# EAGLE design VizeSinavi (EAGLE 9.6.2)
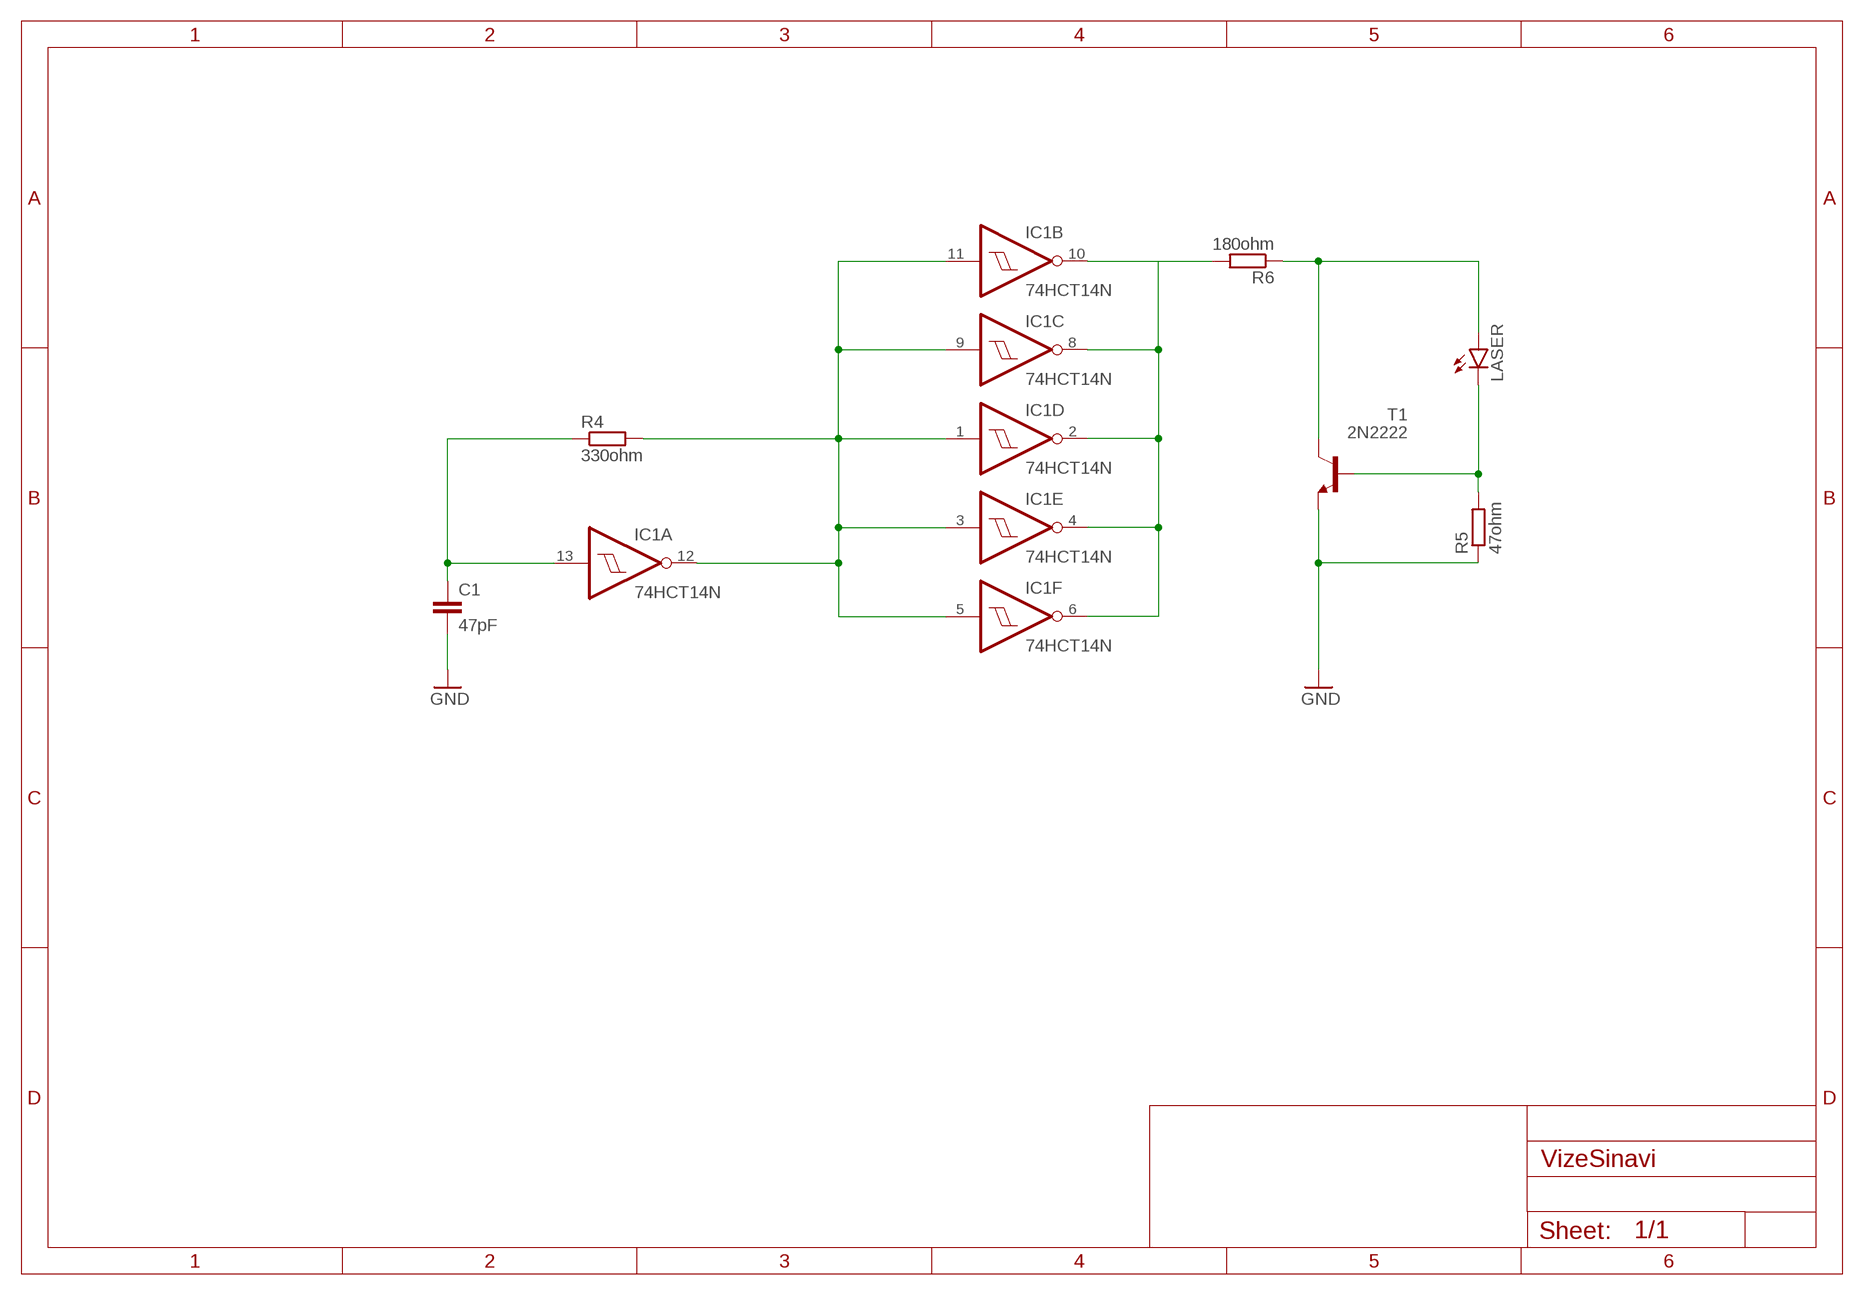
[diagram p0: schematic, sheet 1]

## Parts
C1  47pF  C2,5-3  [C2.5-3]
IC1  74HCT14N  [DIL14]
LASER  LED5MM  [LED5MM]
R4  330ohm  R-EU_0204/5  [0204/5]
R5  47ohm  R-EU_0204/5  [0204/5]
R6  180ohm  R-EU_0204/5  [0204/5]
T1  2N2222  [TO18]

## Nets
GND: C1.2 R5.1 T1.1(E)
N$1: C1.1 IC1.13(A:I) R4.1
N$2: IC1.1(D:I) IC1.3(E:I) IC1.5(F:I) IC1.9(C:I) IC1.11(B:I) IC1.12(A:O) R4.2
N$3: IC1.10(B:O) R6.2
N$4: IC1.2(D:O) IC1.4(E:O) IC1.6(F:O) IC1.8(C:O)
N$5: LASER.A R6.1 T1.3(C)
N$6: LASER.K(C) R5.2 T1.2(B)

## Power pins joined to a net without a drawn wire
GND: IC1.7(P:GND)
VCC: IC1.14(P:VCC)

## Library data of the parts
C1 = capacitor-wima:C: CAPACITOR naming: grid - package width
IC1 = 74xx-eu:74*14: Hex schmitt trigger INVERTER
LASER = led:LED: LED OSRAM: - CHIPLED LG R971, LG N971, LY N971, LG Q971, LY Q971, LO R971, LY R971 LH N974, LH R974 LS Q976, LO Q976, LY Q976 LO Q996 - Hyper CHIPLED LW Q18S LB Q993, LB Q99A, LB R99A - SideLED LS A670, LO A670, LY A670, LG A670, LP A670 LB A673, LV A673, LT A673, LW A673 LH A674 LY A675 LS A676, LA A676, LO A676, LY A676, LW A676 LS A679, LY A679, LG A679 - Hyper Micro SIDELED® LS Y876, LA Y876, LO Y876, LY Y876 LT Y87S - SmartLED LW L88C, LW L88S LB L89C, LB L89S, LG L890 LS L89K, LO L89K, LY L89K LS L896, LA L896, LO L896, LY L896 - TOPLED LS T670, LO T670, LY T670, LG T670, LP T670 LSG T670, LSP T670, LSY T670, LOP T670, LYG T670 LG T671, LOG T671, LSG T671 LB T673, LV T673, LT T673, LW T673 LH T674 LS T676, LA T676, LO T676, LY T676, LB T676, LH T676, LSB T676, LW T676 LB T67C, LV T67C, LT T67C, LS T67K, LO T67K, LY T67K, LW E67C LS E67B, LA E67B, LO E67B, LY E67B, LB E67C, LV E67C, LT E67C LW T67C LS T679, LY T679, LG T679 LS T770, LO T770, LY T770, LG T770, LP T770 LB T773, LV T773, LT T773, LW T773 LH T774 LS E675, LA E675, LY E675, LS T675 LS T776, LA T776, LO T776, LY T776, LB T776 LHGB T686 LT T68C, LB T68C - Hyper Mini TOPLED® LB M676 - Mini TOPLED Santana® LG M470 LS M47K, LO M47K, LY M47K Source: http://www.osram.convergy.de LUXEON: - LUMILED® LXK2-PW12-R00, LXK2-PW12-S00, LXK2-PW14-U00, LXK2-PW14-V00 LXK2-PM12-R00, LXK2-PM12-S00, LXK2-PM14-U00 LXK2-PE12-Q00, LXK2-PE12-R00, LXK2-PE12-S00, LXK2-PE14-T00, LXK2-PE14-U00 LXK2-PB12-K00, LXK2-PB12-L00, LXK2-PB12-M00, LXK2-PB14-N00, LXK2-PB14-P00, LXK2-PB14-Q00 LXK2-PR12-L00, LXK2-PR12-M00, LXK2-PR14-Q00, LXK2-PR14-R00 LXK2-PD12-Q00, LXK2-PD12-R00, LXK2-PD12-S00 LXK2-PH12-R00, LXK2-PH12-S00 LXK2-PL12-P00, LXK2-PL12-Q00, LXK2-PL12-R00 Source: www.luxeon.com KINGBRIGHT: KA-3528ASYC Source: www.kingbright.com
R4-R6 = rcl:R-EU_: RESISTOR, European symbol; SPICEPREFIX: R
T1 = transistor:2N2222: NPN TRANSISTOR

## Board
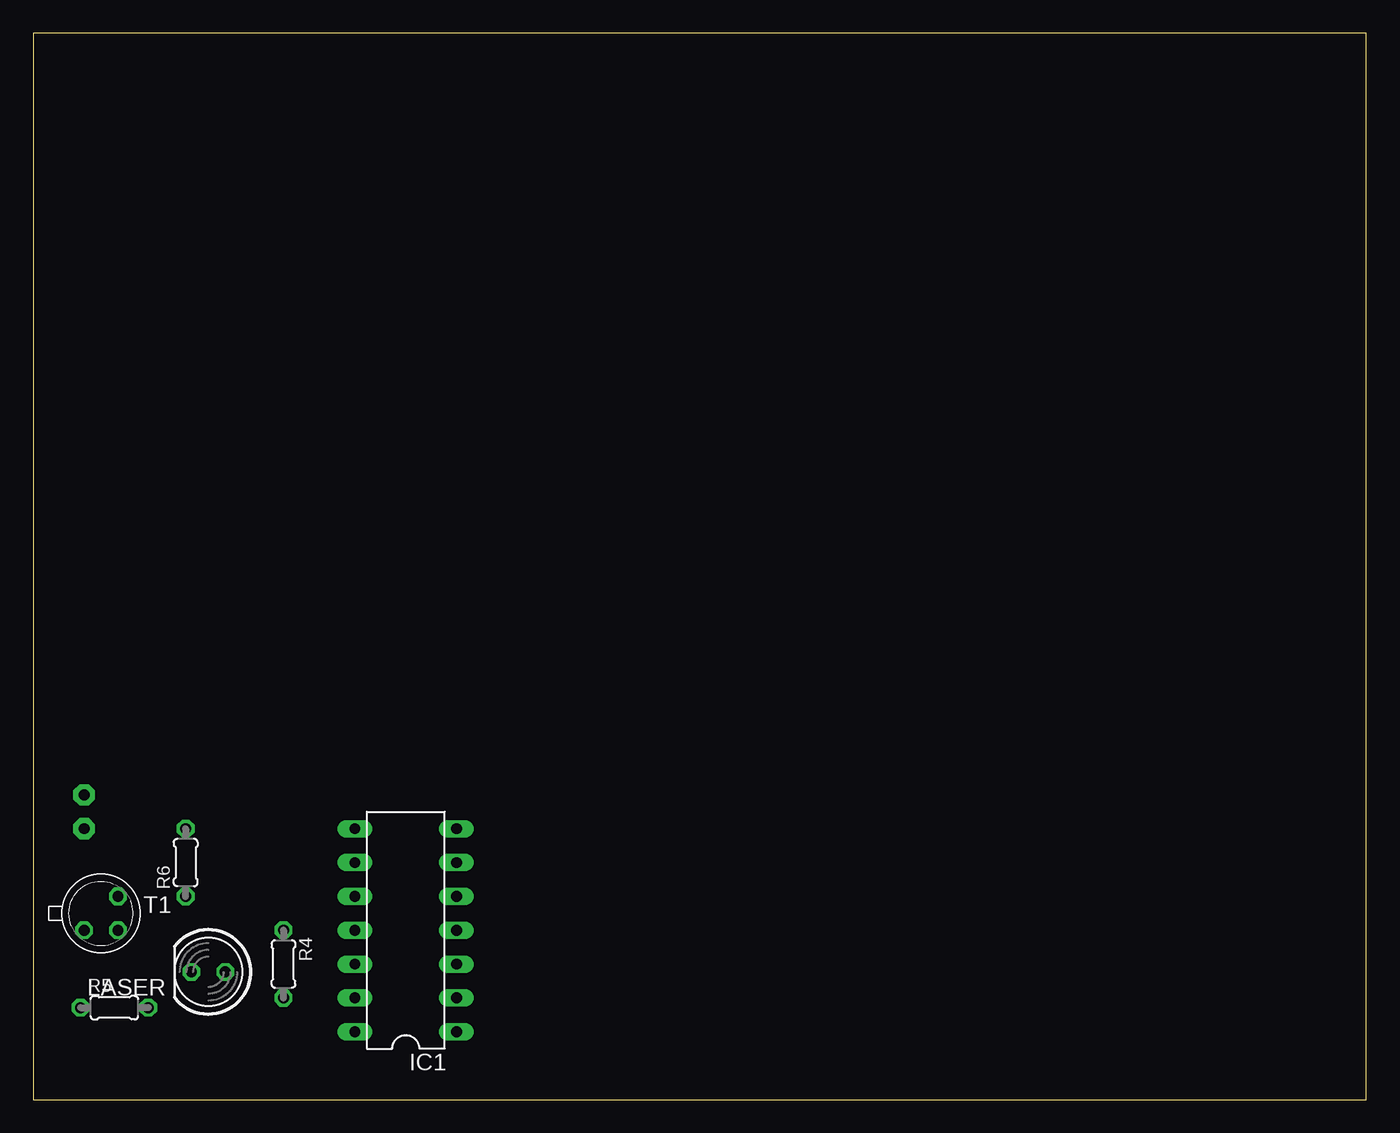
[diagram p1: board, top side]
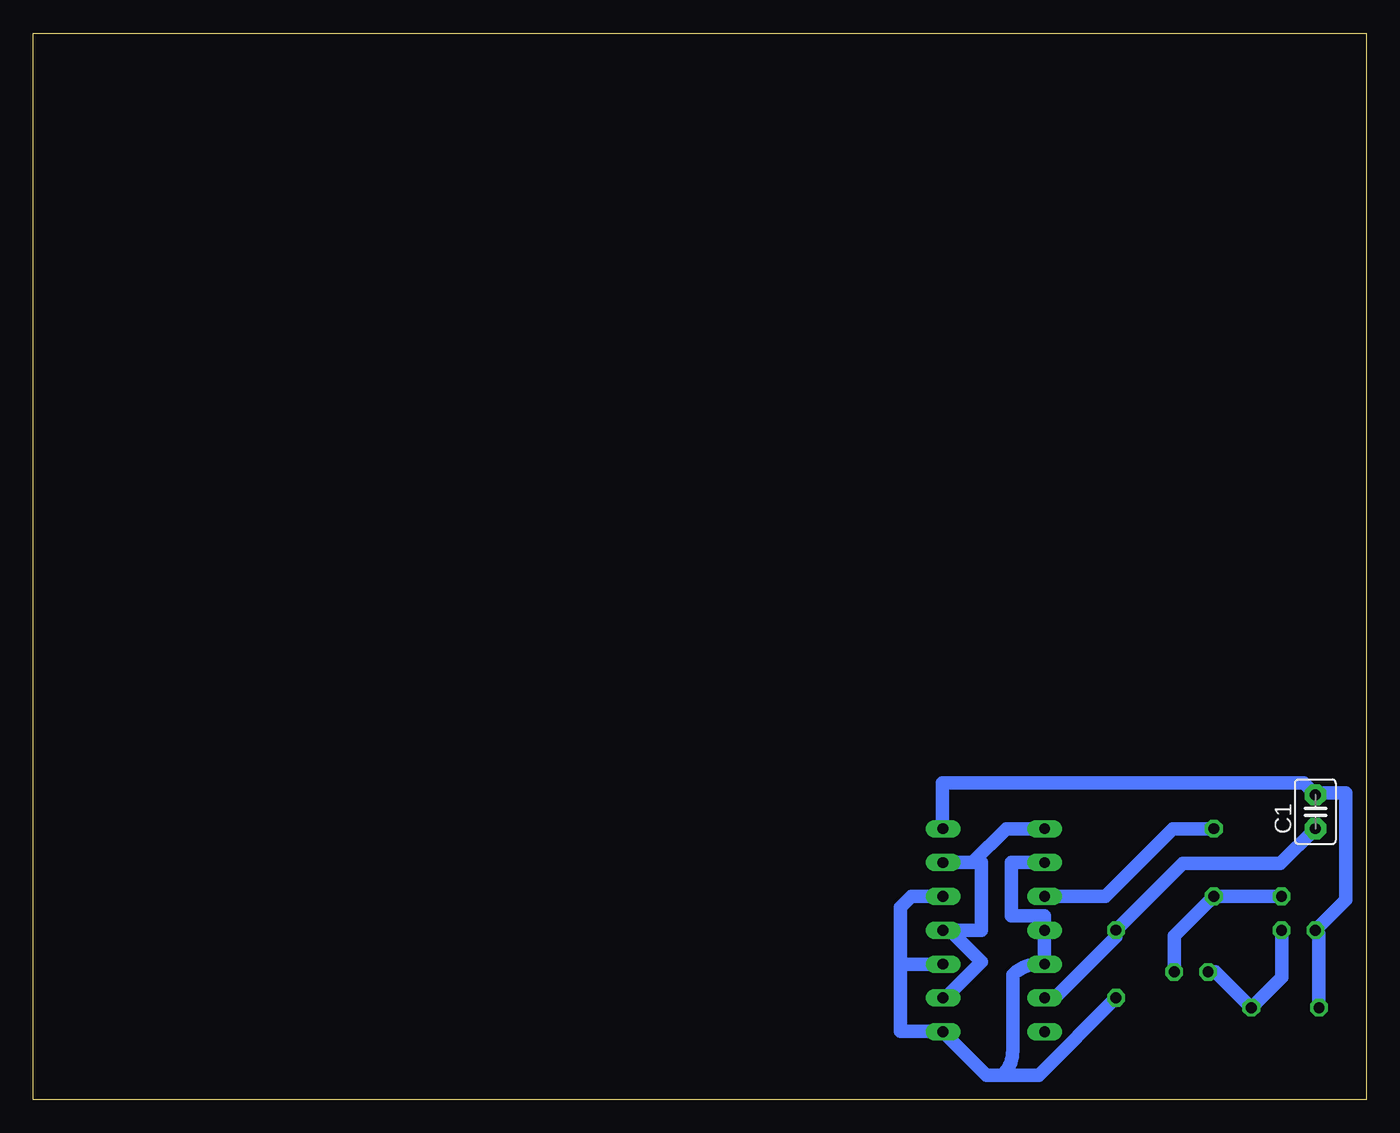
[diagram p2: board, bottom side, seen from below]

Size 100 x 80 mm. Coordinates in mm from the lower left corner, seen from the top.
Outline: 0,0 100,0 100,80 0,80 0,0
Copper layers (1*16): Top 0.035mm / dielectric 1.5mm / Bottom 0.035mm
Design rules "default": minimum track width 6mil, minimum drill 0.35mm, track to track 6mil, track to pad 6mil, pad to pad 6mil, via to via 6mil, smd to smd 6mil, copper to edge 40mil, drill to drill 6mil, minimum pad ring 10mil, minimum via ring 8mil, stop-mask expansion 4mil, vias tented up to drill 0mil, thermal gap 10mil

### Footprints (pad centres in the part's own frame; a part is rotated, then mirrored left to right if it is on the bottom)
C2.5-3 = drill 0.813 pad 1.6 octagon: 1 -1.27,0; 2 1.27,0
DIL14 = drill 0.813 long: 1 -7.62,-3.81; 2 -5.08,-3.81; 3 -2.54,-3.81; 4 0,-3.81; 5 2.54,-3.81; 6 5.08,-3.81; 7 7.62,-3.81; 8 7.62,3.81; 9 5.08,3.81; 10 2.54,3.81; 11 0,3.81; 12 -2.54,3.81; 13 -5.08,3.81; 14 -7.62,3.81
LED5MM = drill 0.813 octagon: A -1.27,0; K 1.27,0
0204/5 = drill 0.813 octagon: 1 -2.54,0; 2 2.54,0
TO18 = drill 0.813 octagon: 1 -1.27,-1.27; 2 1.27,-1.27; 3 1.27,1.27

### Placement (x,y rotation side)
C1  3.81,21.59 90 bottom
IC1  27.94,12.7 90 top
LASER  13.13,9.58 180 top
R4  18.77,10.17 270 top
R5  6.08,6.89 0 top
R6  11.43,17.78 90 top
T1  5.08,13.97 0 top

### Tracks (layer width: path | path; a pad name or v marks a point on that pad's centre or on a via)
GND
  Bottom 1.016: R5.1 3.54,12.43 T1.1 1.52,14.99 1.52,23.01 3.66,23.01 C1.2 4.7,23.75 31.8,23.75 31.8,20.37 IC1.7
N$1
  Bottom 1.016: IC1.13 23.35,7.62 18.77,12.2 R4.1 13.77,17.7 6.43,17.7 C1.1
N$2
  Bottom 1.016: 34.95,9.88 34.95,5.11 31.77,5.11 IC1.1 28.5,1.83 27.28,1.83 | 34.95,9.88 34.67,10.16 IC1.3 | 34.95,9.88 34.95,14.4 34.11,15.24 IC1.5 | R4.2 24.57,1.83 27.28,1.83 | 27.28,1.83 27.26,1.85 arc-45 26.52,3.64 26.52,9.35 26.45,9.42 arc45 24.65,10.16 IC1.12 IC1.11 24.13,13.79 26.62,13.79 26.62,17.78 IC1.9
N$3
  Bottom 1.016: R6.2 14.5,20.32 19.58,15.24 IC1.10
N$4
  Bottom 1.016: IC1.8 27,20.32 29.54,17.78 IC1.6 28.88,17.78 28.88,12.7 IC1.4 31.24,12.7 28.87,10.32 31.57,7.62 IC1.2
N$5
  Bottom 1.016: T1.3 R6.1 14.4,12.27 LASER.A
N$6
  Bottom 1.016: T1.2 6.35,9.16 R5.2 11.31,9.58 LASER.K